# Altium schematic sheet ResetCkt.SchDoc
size A
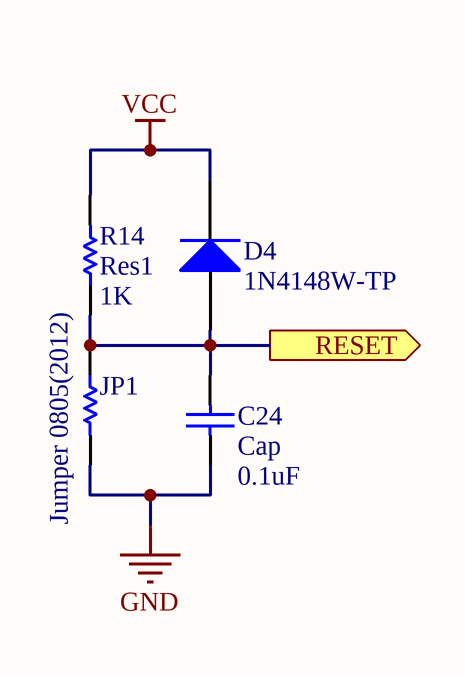
[diagram p0: ResetCkt.SchDoc]

## Parts
C24  Cap  value 0.1uF  [C0805]
D4  1N4148W-TP  [MCC-SOD123_V]
JP1  Jumper 0805(2012)  [RESC0805(2012)_N]
R14  Res1  value 1K  [6-0805_L]

## Ports
RESET (out)

## Nets
GND: C24.1 JP1.2
VCC: D4.2(K) R14.2
RESET: C24.2 D4.1(A) JP1.1 R14.1 ; port RESET

## Library data of the parts
C24 = Cap: Capacitor; Published: 8-Jun-2000; LatestRevisionDate: 17-Jul-2002; LatestRevisionNote: Re-released for DXP Platform.; PackageReference: RAD-0.3; Publisher: Altium Limited; PackageDescription: MLCC_0805
D4 = CMP-2000-04993-1: High Speed Switching Diode, 400 mW, 150 mA, -65 to 150 degC, 2-Pin SOD123, RoHS, Tape and Reel; Manufacturer: Micro Commercial Components; Reverse Recovery Time-Max: 4ns; Average Forward Current-Max: 0.15A; Peak Current-Max: 2A; Power Dissipation: 400mW; Reverse Voltage-Max [Vrrm]: 100V; Datasheet URL: https://datasheet.ciiva.com/16836/1n4148wsod123-16836277.pdf; Package Reference: SOD123; Package URL: http://www.mccsemi.com/up_pdf/1N4448W(SOD-123).pdf; Package Description: 2-Pin Small Outline Diode, Body 2.7 x 1.6 mm, Height 1.35 mm; Manufacturer URL: http://www.mccsemi.com/; Datasheet Version: Rev. C, 07/2014
JP1 = CMP-1013-00001-1: Jumper 0805 (2012 Metric); Case-EIA: 0805; Value: 0.00 Ohm; Tolerance: None; Case-Metric: 2012; Technology: SMT; Power: None
R14 = Res1: Resistor; Published: 8-Jun-2000; LatestRevisionDate: 17-Jul-2002; LatestRevisionNote: Re-released for DXP Platform.; PackageReference: AXIAL-0.3; Publisher: Altium Limited; PackageDescription: Axial Device, Thru-Hole; 2 Leads; 0.3 in Pin Spacing